# EasyEDA Pro project Sound&Light IC evaluation board.eprj

# Schematic Schematic1
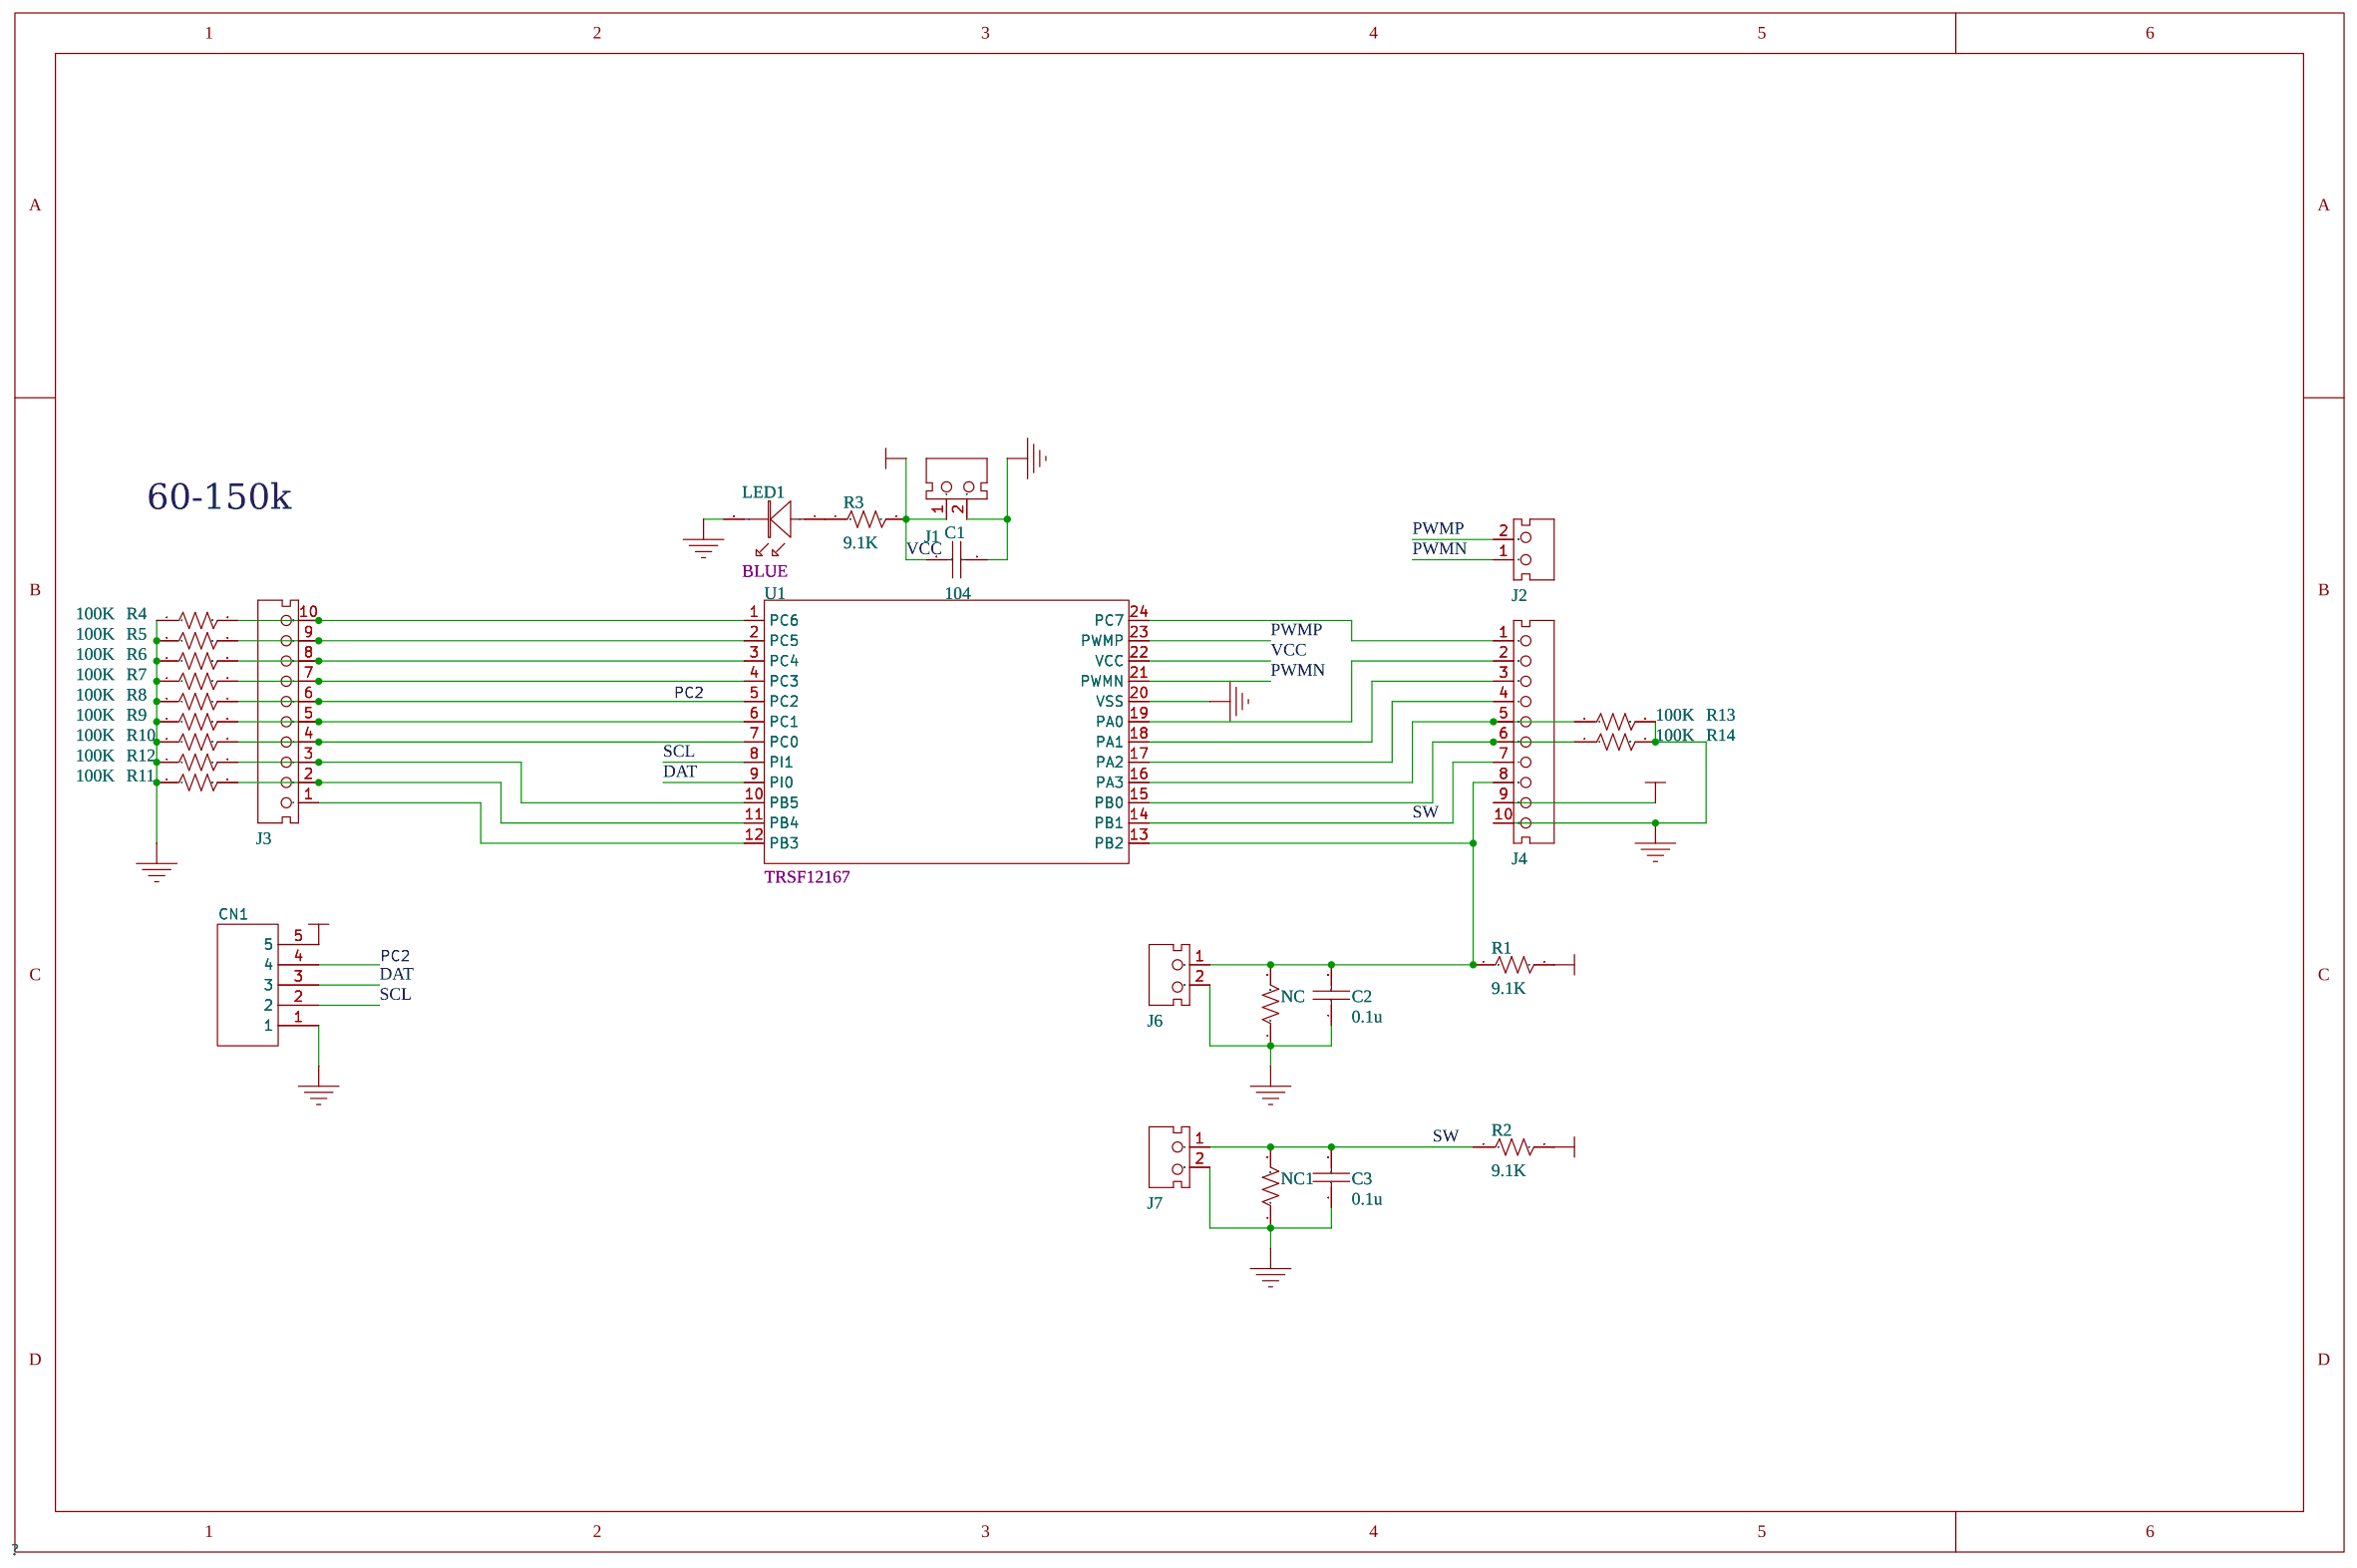
[diagram p0: schematic sheet]

## Parts
C1  104  [CAPC0603-RW]
C2  0.1u  [CAPC0603-RW]
C3  0.1u  [CAPC0603-RW]
CN1  -  [CONN-TH_640456-5]
J1  2.5mm  [CONN 2P PH=2.5mm HAA250A-2 WHITE]
J2  2.5mm  [CONN 2P PH=2.5mm HAA250A-2 WHITE]
J3  2.5mm  [CONN 10P PH=2.5mm ST CI2210P1VK0-NH]
J4  2.5mm  [CONN 10P PH=2.5mm ST CI2210P1VK0-NH]
J6  2.5mm  [CONN 2P PH=2.5mm HAA250A-2 WHITE]
J7  2.5mm  [CONN 2P PH=2.5mm HAA250A-2 WHITE]
LED1  T575011480204  [LED0603_BLUE]
NC  9.1K  [0603-RW]
NC1  9.1K  [0603-RW]
R1  9.1K  [0603-RW]
R2  9.1K  [0603-RW]
R3  9.1K  [0603-RW]
R4  100K  [0603-RW]
R5  100K  [0603-RW]
R6  100K  [0603-RW]
R7  100K  [0603-RW]
R8  100K  [0603-RW]
R9  100K  [0603-RW]
R10  100K  [0603-RW]
R11  100K  [0603-RW]
R12  100K  [0603-RW]
R13  100K  [0603-RW]
R14  100K  [0603-RW]
U1  BS86C08C 24SSOP  [SSOP24(150mil)]

## Library data of the parts
C1-C3 = T542021036508: CAP X7R .01UF 50V +-5% 0603 WALSIN L; Vendor Name: *; MFG: WALSIN; MFG Part: *; Other: X7R; Tolerance: 5%; Type: Capacitor; CREATE_NAME: Nathan; CREATE_TIME: 13-July-2016; Voltage: 16v; DIP&SMD: SMD; Customer Specific: N/A; Origin Footprint 2: CAPC0603-SW
CN1 = 640456-5: 参考系列:-;间距:2.54mm;插针结构:1x5P;排数:1;每排PIN数:5;行距:-;安装方式:-;触头材质:铜合金;; LCSC Part Name: 矩形电源连接器  5P 2.54mm 直插 直插; Supplier Part: C86505; Manufacturer: TE Connectivity(美国泰科); Supplier Footprint: 插件,P=2.54mm; JLCPCB Part Class: Extended Part; Datasheet: https://atta.szlcsc.com/upload/public/pdf/source/20161105/1478330334867.pdf; Supplier: LCSC; Pitch: 2.54mm; Pins Structure: 1x5P; Number of Rows: 1; Number of PINs Per Row: 5; Contact Material: 铜合金
J1 J2 J6 J7 = T690300125300: CONNECTOR HA2.5 2PIN BLACK K; MFG: 金瑞康; MFG Part: HAA250A-2 BLACK; Vendor Name: *; Vendor Code: *; Type: Connector; CREATE_NAME: Nathan; CREATE_TIME: 24-Nov-2017; Current: 3A; DIP&SMD: DIP
J3 J4 = T690300105400: WTB CONN. 2.5MM 10PIN CI2210P1VK0-NH CV G; MFG: CVILUX; MFG Part: CI2210P1VK0-NH; Vendor Name: *; Vendor Code: *; Type: Connector; CREATE_NAME: Nathan; CREATE_TIME: 21-Mar-2017; Current: *; DIP&SMD: DIP
LED1 = T575011480204: LED 465 0603 LTST-C193TBK LITEON ( L; MFG Part: LTST-C193TBKT-5A; Vendor Code: *; Vendor Name: *; MFG: LITEON (光寶); Type: LED; CREATE_TIME: 28-Feb-2019; CREATE_NAME: Nathan; Lens Type: WALTER CLEAR; DIP&SMD: SMD; Color: BLUE
NC NC1 R1-R14 = T502294202399: CHIP 29.4K OHM 100PPM +-1% 0603 WALS L; Vendor Code: *; Power: 1/10W; Vendor Name: *; MFG: WALSIN; MFG Part: WR06X2942FTL; Type: Resistor; CREATE_NAME: Tom; CREATE_TIME: 14-Sep-2016; TOL: +-0.1%; DIP&SMD: SMD; Customer Specific: N/A; Origin Footprint 2: 0603-SW
U1 = BS86C08C 24SSOP: BS86C08C_24SSOP; MFG: HOLTEK; Vendor Code: *; Vendor Name: *; SAP: *; Type: IC; CREATE_NAME: Nathan; CREATE_TIME: 16-Sep-2020; DIP&SMD: SMD; Customer Specific: N/A; MFG Part: TRSF12167

## Nets
GND: C1.1 C2.1 C3.1 CN1.1 J1.2 J4.10 J6.2 J7.2 LED1.2(K) NC.1 NC1.1 R4.1 R5.1 R6.1 R7.1 R8.1 R9.1 R10.1 R11.1 R12.1 R13.2 R14.2 U1.20(VSS)
VCC: C1.2 CN1.5 J1.1 J4.9 R1.2 R2.2 R3.2 U1.22(VCC)
DAT: CN1.3 U1.9(PI0)
PC2: CN1.4 J3.6 R8.2 U1.5(PC2)
PWMN: J2.1 U1.21(PWMN)
PWMP: J2.2 U1.23(PWMP)
SCL: CN1.2 U1.8(PI1)
SW: C3.2 J4.7 J7.1 NC1.2 R2.1 U1.14(PB1)
$2N419: J3.10 R4.2 U1.1(PC6)
$2N420: J3.9 R5.2 U1.2(PC5)
$2N421: J3.8 R6.2 U1.3(PC4)
$2N422: J3.7 R7.2 U1.4(PC3)
$2N424: J3.5 R9.2 U1.6(PC1)
$2N429: J3.4 R10.2 U1.7(PC0)
$2N430: J3.3 R12.2 U1.10(PB5)
$2N431: J3.2 R11.2 U1.11(PB4)
$2N432: J3.1 U1.12(PB3)
$2N439: J4.2 U1.19(PA0)
$2N440: J4.3 U1.18(PA1)
$2N441: J4.4 U1.17(PA2)
$2N442: J4.5 R13.1 U1.16(PA3)
$2N443: J4.6 R14.1 U1.15(PB0)
$2N446: J4.1 U1.24(PC7)
$2N447: C2.2 J4.8 J6.1 NC.2 R1.1 U1.13(PB2)
$2N484: LED1.1(A) R3.1

## Notes on the sheet
- 60-150k

# Board Sound&Light IC evaluation board ask
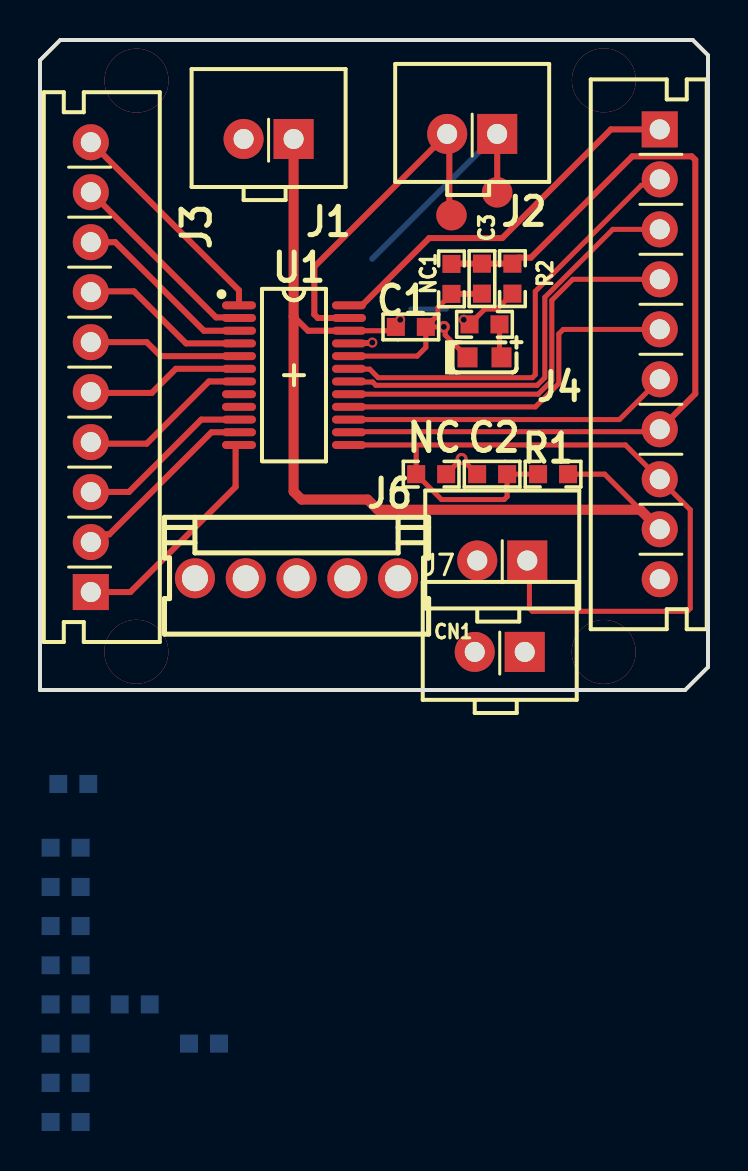
[diagram p1: board, top side]
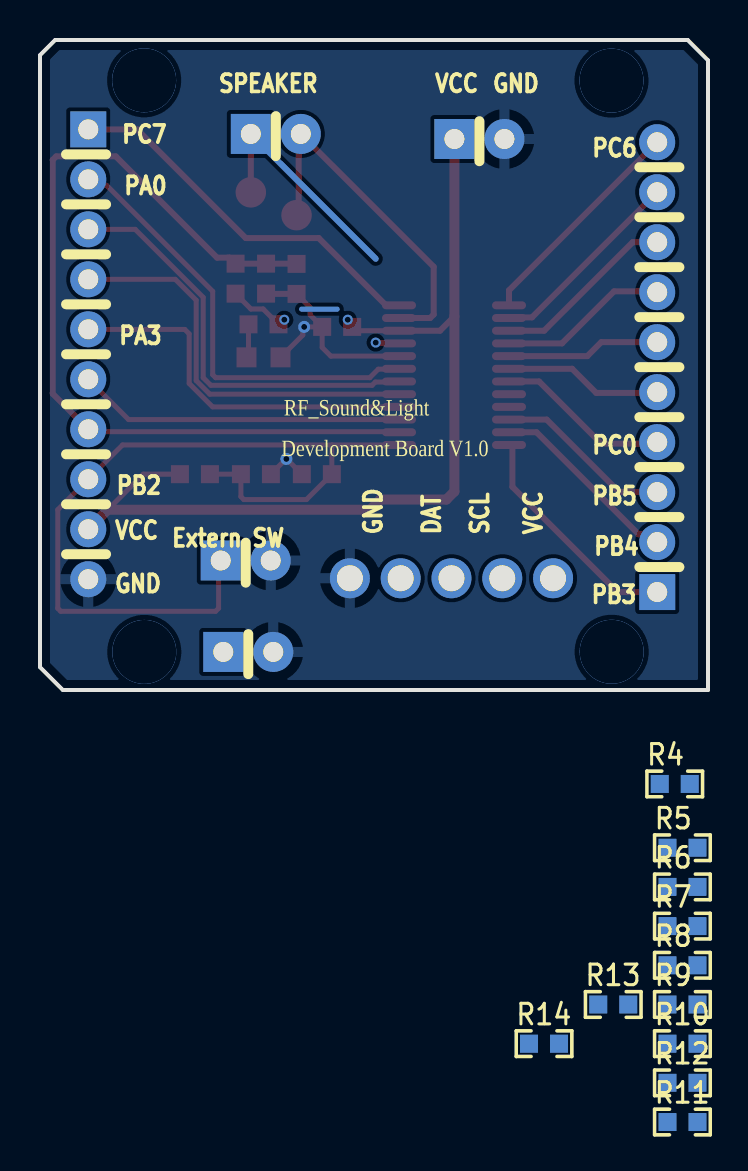
[diagram p2: board, bottom side, seen from below]

Outline 33.4 x 32.51 mm; copper layers: Top Layer, Bottom Layer. Coordinates in mm from the lower left corner of the outline.
Outline path: 0,31.5 1.02,32.51 32.64,32.51 33.4,31.75 33.4,1.14 32.26,0 0,0 0,31.5
Stack: Top Layer 0.0356mm / Dielectric 1 0.32mm FR-4 er 4.8 / Bottom Layer 0.0356mm

## Design rules (mm)
spacing Clearance (default): track to track 0.1, other pairs 0.1 to 0.1
track width Width (default): min 0.1, default 0.254, max 1
differential pair DiffPairsRouting (default): width min 0.381, default 0.381, max 0.381; gap min 0.254, default 0.254
via viaSize (default): diameter min 0.5, default 0.61, max 10; hole min 0.3, default 0.305, max 6

## Placement (name value [footprint] x y rotation side)
C1  104  [CAPC0603-RW]  18.54 18.16 180 top
C2  0.1u  [CAPC0603-RW]  22.61 10.8 0 top
C3  0.1u  [CAPC0603-RW]  22.1 20.57 90 top
CN1  -  [CONN-TH_640456-5]  12.83 5.59 180 top
J1  2.5mm  [CONN 2P PH=2.5mm HAA250A-2 WHITE]  11.43 27.56 0 top
J2  2.5mm  [CONN 2P PH=2.5mm HAA250A-2 WHITE]  21.61 27.81 0 top
J3  2.5mm  [CONN 10P PH=2.5mm ST CI2210P1VK0-NH]  2.54 16.15 270 top
J4  2.5mm  [CONN 10P PH=2.5mm ST CI2210P1VK0-NH]  30.99 16.79 90 top
J6  2.5mm  [CONN 2P PH=2.5mm HAA250A-2 WHITE]  23.11 6.48 0 top
J7  2.5mm  [CONN 2P PH=2.5mm HAA250A-2 WHITE]  22.99 1.91 0 top
LED1  T575011480204  [LED0603_BLUE]  22.23 16.64 0 top
NC  9.1K  [0603-RW]  19.56 10.8 180 top
NC1  9.1K  [0603-RW]  20.57 20.56 90 top
NOREF  -  [Pad_ie2]  20.57 23.75 0 top
NOREF#2  -  [Pad_ie3]  22.86 24.89 0 top
R1  9.1K  [0603-RW]  25.65 10.8 0 top
R2  9.1K  [0603-RW]  23.62 20.57 270 top
R3  9.1K  [0603-RW]  22.23 18.29 180 top
R4  100K  [0603-RW]  1.66 -4.7 180 bottom
R5  100K  [0603-RW]  1.28 -7.89 180 bottom
R6  100K  [0603-RW]  1.28 -9.85 180 bottom
R7  100K  [0603-RW]  1.28 -11.81 180 bottom
R8  100K  [0603-RW]  1.28 -13.77 180 bottom
R9  100K  [0603-RW]  1.28 -15.73 180 bottom
R10  100K  [0603-RW]  1.28 -17.69 180 bottom
R11  100K  [0603-RW]  1.28 -21.61 180 bottom
R12  100K  [0603-RW]  1.28 -19.65 180 bottom
R13  100K  [0603-RW]  4.74 -15.73 180 bottom
R14  100K  [0603-RW]  8.2 -17.69 180 bottom
U1  BS86C08C 24SSOP  [SSOP24(150mil)]  12.7 15.75 270 top

## Footprints (pads in the part's own frame, mm; a bottom-side part is the same pattern mirrored in y, then rotated)
0603-RW
  rect 0.9x0.9 smd: 1(-0.75,0) 2(0.75,0)
CAPC0603-RW
  rect 0.9x0.9 smd: 1(-0.75,0) 2(0.75,0)
CONN 2P PH=2.5mm HAA250A-2 WHITE
  rect 2x2 hole 1: 1(1.25,0)
  round 2 hole 1: 2(-1.25,0)
CONN 10P PH=2.5mm ST CI2210P1VK0-NH
  rect 1.8x1.8 hole 1: 1(11.25,0)
  round 1.8 hole 1: 2(8.75,0) 3(6.25,0) 4(3.75,0) 5(1.25,0) 6(-1.25,0) 7(-3.75,0) 8(-6.25,0) 9(-8.75,0) 10(-11.25,0)
CONN-TH_640456-5
  round 1.999 hole 1.3: 1(-5.08,0) 2(-2.54,0) 3(0,0) 4(2.54,0) 5(5.08,0)
LED0603_BLUE
  rect 1x1 smd: 1(0.85,0) 2(-0.85,0)
Pad_ie2
  round 1.524 smd: 2(0,0)
Pad_ie3
  round 1.524 smd: 2(0,0)
SSOP24(150mil)
  oval 0.4x1.7 smd: 1(-3.493,-2.75) 2(-2.857,-2.75) 3(-2.223,-2.75) 4(-1.587,-2.75) 5(-0.953,-2.75) 6(-0.318,-2.75) 7(0.318,-2.75) 8(0.953,-2.75) 9(1.587,-2.75) 10(2.223,-2.75) 11(2.857,-2.75) 12(3.493,-2.75) 13(3.493,2.75) 14(2.857,2.75) 15(2.223,2.75) 16(1.587,2.75) 17(0.953,2.75) 18(0.318,2.75) 19(-0.318,2.75) 20(-0.953,2.75) 21(-1.587,2.75) 22(-2.223,2.75) 23(-2.857,2.75) 24(-3.493,2.75)

## Nets
As in the schematic, except:
PWMN: J2.1 NOREF#2.2 U1.21
PWMP: J2.2 NOREF.2 U1.23

## Via types
v1: diameter 3.2, hole 3.2, Top Layer to Bottom Layer, 4 vias
v2: diameter 0.5, hole 0.3, Top Layer to Bottom Layer, 3 vias
v3: diameter 0.6, hole 0.3, Top Layer to Bottom Layer, 2 vias

## Routing (per net, layer and track width the routed paths; a pad name or vN(x,y) marks a point on that pad's centre or on a via; arc(x,y) is an arc through that point)
GND: length 13.9
  Top Layer w0.25: NC1.1 19.9,19.13 19.9,18.76 C1.1 ; C2.1 21.09,11.56 v3(21.08,11.56) 21.07,11.56 NC.1 ; C1.1 v3(20.19,18.16) 20.26,18.09 20.26,17.75 LED1.2 ; C1.1 19.29,17.13 18.86,16.7 U1.20
  Top Layer w0.3: C3.1 22.09,19.81 NC1.1
VCC: length 51.2
  Top Layer w0.254: R3.2 22.24,19.06 22.85,19.06 R2.2 ; U1.22 17.6,17.97 C1.2 ; 30.01,9.02 28.23,10.8 R1.2 26.45,10.75
  Top Layer w0.3: U1.22 13.4,17.97 12.68,18.69
  Top Layer w0.5: J1.1 12.68,9.93 13.08,9.52 16.38,9.52 16.89,9.02 30.01,9.02 J4.9
  Bottom Layer w0.254: 18.54,19.05 20.32,19.05
  vias: v2(18.01,18.52) v2(21.19,18.52)
(no net):
  vias: v1(4.83,30.48) v1(4.82,1.91) v1(28.19,30.49) v1(28.19,1.91)
PC2: length 7.7
  Top Layer w0.3: J3.6 5.33,17.4 6.03,16.7 U1.5
PWMN: length 13
  Top Layer w0.3: NOREF#2.2 J2.1 ; U1.21 15.47,17.35 16.59,17.35 v2(16.62,17.38) 16.64,17.4
  Bottom Layer w0.3: 16.62,21.57 J2.1
PWMP: length 17.7
  Top Layer w0.3: U1.23 13.89,18.61 13.72,18.78 13.72,21.17 J2.2 20.47,27.71 20.47,23.86 NOREF.2
SW: length 44.3
  Top Layer w0.25: U1.14 15.48,12.92 30.87,12.92 J4.7
  Top Layer w0.3: J4.7 32.77,14.82 32.77,26.52 32.59,26.69 29.61,26.69 24.55,21.62 23.92,21.62 R2.1 C3.2 20.59,21.32 NC1.2
$2N419: length 11.2
  Top Layer w0.3: J3.10 9.95,19.99 U1.1
$2N420: length 10
  Top Layer w0.3: U1.2 9.27,18.61 9.24,18.64 8.8,18.64 J3.9
$2N421: length 9.2
  Top Layer w0.3: J3.8 3.76,22.4 8.19,17.97 U1.3
$2N422: length 8.5
  Top Layer w0.3: J3.7 2.58,19.94 4.7,19.94 7.3,17.34 U1.4
$2N424: length 7.9
  Top Layer w0.3: J3.5 2.58,14.86 5.59,14.86 6.79,16.07 U1.6
$2N429: length 8.7
  Top Layer w0.3: U1.7 8.45,15.43 5.33,12.32 2.62,12.32 J3.4
$2N430: length 8.9
  Top Layer w0.3: J3.3 2.55,9.91 4.45,9.91 8.06,13.53 U1.10
$2N431: length 9.7
  Top Layer w0.3: U1.11 8.57,12.89 3.47,7.78 3.33,7.78 2.95,7.4 J3.2
$2N432: length 11.7
  Top Layer w0.3: U1.12 9.83,12.26 9.78,12.21 9.78,10.16 4.52,4.9 J3.1
$2N439: length 22.3
  Top Layer w0.25: J4.2 30.69,25.24 30.07,25.24 24.77,19.94 24.77,15.77 24.62,15.62 16.91,15.62 16.48,16.05 15.47,16.05 U1.19
$2N440: length 21.2
  Top Layer w0.25: J4.3 28.64,23.04 25.24,19.64 25.24,15.62 24.86,15.24 16.8,15.24 16.63,15.4 15.48,15.4 U1.18
$2N441: length 20.3
  Top Layer w0.25: U1.17 24.91,14.8 25.59,15.48 25.59,19.5 26.64,20.54 J4.4
$2N442: length 18.6
  Top Layer w0.25: U1.16 24.77,14.16 25.94,15.33 25.94,17.81 26.16,18.03 30.98,18.03 J4.5
$2N443: length 16.4
  Top Layer w0.25: U1.15 28.97,13.53 J4.6
$2N446: length 19.2
  Top Layer w0.3: U1.24 16.1,19.24 19.47,22.61 23.11,22.61 28.55,28.04 J4.1
$2N447: length 42.1
  Top Layer w0.25: U1.13 18.8,12.26 ; 18.8,12.26 29.27,12.26 J4.8 32.51,9.02 32.51,4.08 32.37,3.94 24.62,3.94 24.47,4.09 24.47,5.46 ; 18.8,12.26 18.81,12.24 NC.2 20.08,9.52 23.21,9.52 23.36,9.67 C2.2 R1.1
$2N484: length 1.7
  Top Layer w0.25: R3.1 22.98,16.74 LED1.1

## Copper pours and planes (outline as drawn; the poured copper is in the pictures)
GND on Bottom Layer: 0,0 32.26,0 33.53,1.27 33.53,31.75 32.64,32.64 1.02,32.64 0,31.62

## Text on the board
Bottom Silkscreen Layer: VCC | SCL | DAT | GND | PB4 | PC6 | PC0 | PB5 | PB3 | SPEAKER | Extern SW | PA0 | PC7 | PA3 | PB2 | RF_Sound&Light | Development Board V1.0
